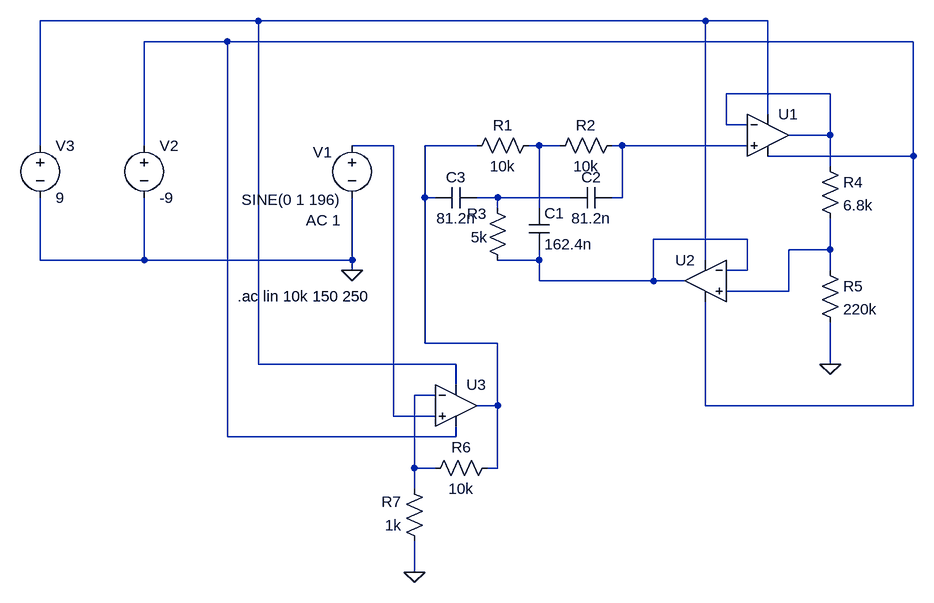
[diagram p0: schematic ActiveNotchFilter.asc]
ActiveNotchFilter.asc, the LTspice schematic file:
Version 4
SHEET 1 880 740
WIRE -240 -128 -576 -128
WIRE 448 -128 -240 -128
WIRE 544 -128 448 -128
WIRE -288 -96 -416 -96
WIRE 768 -96 -288 -96
WIRE 640 -16 480 -16
WIRE 544 16 544 -128
WIRE 480 32 480 -16
WIRE 512 32 480 32
WIRE 640 48 640 -16
WIRE 640 48 576 48
WIRE -576 64 -576 -128
WIRE -416 64 -416 -96
WIRE -32 64 -96 64
WIRE 96 64 16 64
WIRE 192 64 176 64
WIRE 224 64 192 64
WIRE 320 64 304 64
WIRE 512 64 320 64
WIRE 768 80 768 -96
WIRE 768 80 544 80
WIRE 640 96 640 48
WIRE 16 144 16 64
WIRE 32 144 16 144
WIRE 128 144 96 144
WIRE 240 144 128 144
WIRE 320 144 320 64
WIRE 320 144 304 144
WIRE 128 160 128 144
WIRE 192 160 192 64
WIRE 512 208 368 208
WIRE 640 224 640 176
WIRE 640 224 576 224
WIRE -576 240 -576 144
WIRE -416 240 -416 144
WIRE -416 240 -576 240
WIRE -96 240 -96 144
WIRE -96 240 -416 240
WIRE 192 240 192 224
WIRE 192 240 128 240
WIRE 448 240 448 -128
WIRE -96 256 -96 240
WIRE 512 256 512 208
WIRE 512 256 480 256
WIRE 640 256 640 224
WIRE 192 272 192 240
WIRE 368 272 368 208
WIRE 368 272 192 272
WIRE 416 272 368 272
WIRE 576 288 576 224
WIRE 576 288 480 288
WIRE 16 368 16 144
WIRE 128 368 16 368
WIRE -240 400 -240 -128
WIRE 64 400 -240 400
WIRE 640 400 640 336
WIRE 64 432 64 400
WIRE 32 448 0 448
WIRE 128 464 128 368
WIRE 128 464 96 464
WIRE 448 464 448 304
WIRE 768 464 768 80
WIRE 768 464 448 464
WIRE -32 480 -32 64
WIRE 32 480 -32 480
WIRE -288 512 -288 -96
WIRE 64 512 64 496
WIRE 64 512 -288 512
WIRE 0 560 0 448
WIRE 32 560 0 560
WIRE 128 560 128 464
WIRE 128 560 112 560
WIRE 0 592 0 560
WIRE 0 720 0 672
FLAG 640 400 0
FLAG -96 256 0
FLAG 0 720 0
SYMBOL res 192 48 R90
WINDOW 0 0 56 VBottom 2
WINDOW 3 32 56 VTop 2
SYMATTR InstName R1
SYMATTR Value 10k
SYMBOL res 320 48 R90
WINDOW 0 0 56 VBottom 2
WINDOW 3 32 56 VTop 2
SYMATTR InstName R2
SYMATTR Value 10k
SYMBOL res 112 144 R0
WINDOW 0 -31 25 Left 2
WINDOW 3 -25 61 Left 2
SYMATTR InstName R3
SYMATTR Value 5k
SYMBOL cap 176 160 R0
SYMATTR InstName C1
SYMATTR Value 162.4n
SYMBOL cap 304 128 R90
WINDOW 0 0 32 VBottom 2
WINDOW 3 32 32 VTop 2
SYMATTR InstName C2
SYMATTR Value 81.2n
SYMBOL cap 96 128 R90
WINDOW 0 0 32 VBottom 2
WINDOW 3 32 32 VTop 2
SYMATTR InstName C3
SYMATTR Value 81.2n
SYMBOL voltage -96 48 R0
WINDOW 0 -60 26 Left 2
WINDOW 3 -170 99 Left 2
WINDOW 123 -71 131 Left 2
WINDOW 39 0 0 Left 0
SYMATTR InstName V1
SYMATTR Value SINE(0 1 196)
SYMATTR Value2 AC 1
SYMBOL UniversalOpAmp1 544 48 R0
SYMATTR InstName U1
SYMATTR SpiceLine En=0 Enk=0 In=0 Ink=0 Rin=100Meg
SYMBOL res 624 80 R0
SYMATTR InstName R4
SYMATTR Value 6.8k
SYMBOL res 624 240 R0
SYMATTR InstName R5
SYMATTR Value 220k
SYMBOL UniversalOpAmp1 448 272 M0
SYMATTR InstName U2
SYMATTR SpiceLine En=0 Enk=0 In=0 Ink=0 Rin=100Meg
SYMBOL voltage -416 48 R0
WINDOW 123 0 0 Left 0
WINDOW 39 0 0 Left 0
SYMATTR InstName V2
SYMATTR Value -9
SYMBOL voltage -576 48 R0
WINDOW 123 0 0 Left 0
WINDOW 39 0 0 Left 0
SYMATTR InstName V3
SYMATTR Value 9
SYMBOL UniversalOpAmp1 64 464 R0
SYMATTR InstName U3
SYMBOL res 128 544 R90
WINDOW 0 0 56 VBottom 2
WINDOW 3 32 56 VTop 2
SYMATTR InstName R6
SYMATTR Value 10k
SYMBOL res 16 688 R180
WINDOW 0 36 76 Left 2
WINDOW 3 36 40 Left 2
SYMATTR InstName R7
SYMATTR Value 1k
TEXT -272 296 Left 2 !.ac lin 10k 150 250

The netlist it stands for:
* ActiveNotchFilter.asc
R1 N006 N005 10k
R2 N007 N006 10k
R3 N008 N009 5k
C1 N006 N009 162.4n
C2 N007 N008 81.2n
C3 N008 N005 81.2n
V1 N004 0 SINE(0 1 196) AC 1
XU1 N007 N003 N001 N002 N003 level1 Avol=1Meg GBW=10Meg Vos=0 En=0 Enk=0 In=0 Ink=0 Rin=100Meg  ; pins In+ In- V+ V- OUT
R4 N003 N010 6.8k
R5 N010 0 220k
XU2 N010 N009 N001 N002 N009 level1 Avol=1Meg GBW=10Meg Vos=0 En=0 Enk=0 In=0 Ink=0 Rin=100Meg  ; pins In+ In- V+ V- OUT
V2 N002 0 -9
V3 N001 0 9
XU3 N004 N011 N001 N002 N005 level1 Avol=1Meg GBW=10Meg Vos=0 En=0 Enk=0 In=0 Ink=0 Rin=500Meg  ; pins In+ In- V+ V- OUT
R6 N005 N011 10k
R7 0 N011 1k
.ac lin 10k 150 250
.lib UniversalOpAmp1.lib
.backanno
.end